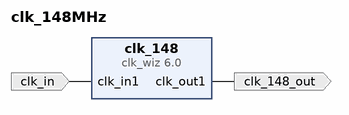
[diagram p0: block diagram of the top level]
# Vivado block design clk_148MHz, xc7z010clg400-1, Vivado 2018.2
create_bd_design clk_148MHz

create_bd_port -dir I -type clk clk_in
set_property -dict {CONFIG.FREQ_HZ 125000000} [get_bd_ports clk_in]
create_bd_port -dir O -type clk clk_148_out
set_property -dict {CONFIG.FREQ_HZ 148500000} [get_bd_ports clk_148_out]

create_bd_cell -type ip -vlnv xilinx.com:ip:clk_wiz:6.0 clk_148
set_property -dict [list \
  CONFIG.PRIM_IN_FREQ 125.000 \
  CONFIG.CLKIN1_JITTER_PS 80.0 \
  CONFIG.CLKOUT1_REQUESTED_OUT_FREQ 148.5 \
  CONFIG.USE_LOCKED false \
  CONFIG.USE_RESET false \
  CONFIG.MMCM_DIVCLK_DIVIDE 5 \
  CONFIG.MMCM_CLKFBOUT_MULT_F 37.125 \
  CONFIG.MMCM_CLKIN1_PERIOD 8.000 \
  CONFIG.MMCM_CLKOUT0_DIVIDE_F 6.250 \
  CONFIG.CLKOUT1_JITTER 216.859 \
  CONFIG.CLKOUT1_PHASE_ERROR 245.344 \
] [get_bd_cells clk_148]

# ---- connections ----

connect_bd_net -net clk_in1_0_1 [get_bd_ports clk_in] [get_bd_pins clk_148/clk_in1]
connect_bd_net -net clk_wiz_0_clk_out1 [get_bd_pins clk_148/clk_out1] [get_bd_ports clk_148_out]

validate_bd_design
save_bd_design
